# Altium schematic sheet PWR.SchDoc
size A4; SheetNumber: 8; SheetTotal: 8
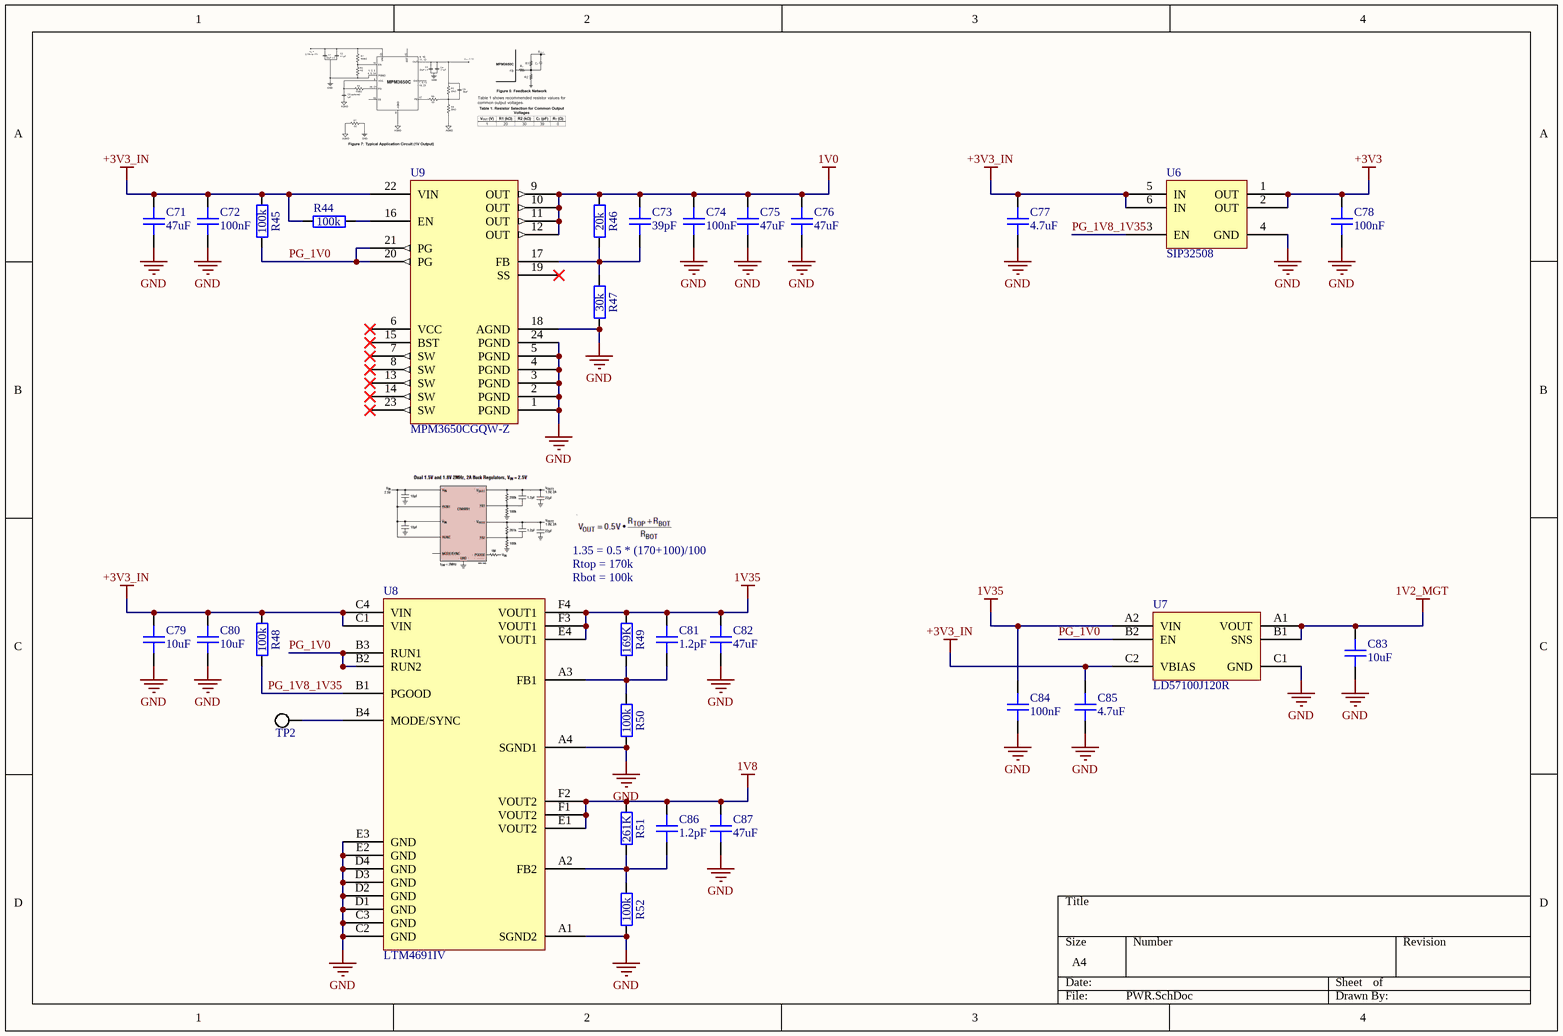
[diagram p0: PWR.SchDoc]

## Parts
C71  47uF  [GEN_C_0805]
C72  100nF  [GEN_C_0402]
C73  39pF  [GEN_C_0402]
C74  100nF  [GEN_C_0402]
C75  47uF  [GEN_C_0805]
C76  47uF  [GEN_C_0805]
C77  4.7uF  [GEN_C_0402]
C78  100nF  [GEN_C_0402]
C79  10uF  [GEN_C_0603]
C80  10uF  [GEN_C_0603]
C81  1.2pF  [GEN_C_0402]
C82  47uF  [GEN_C_0805]
C83  10uF  [GEN_C_0603]
C84  100nF  [GEN_C_0402]
C85  4.7uF  [GEN_C_0402]
C86  1.2pF  [GEN_C_0402]
C87  47uF  [GEN_C_0805]
R44  100k  [GEN_R_0402]
R45  100k  [GEN_R_0402]
R46  20k  [GEN_R_0402]
R47  30k  [GEN_R_0402]
R48  100k  [GEN_R_0402]
R49  169K  [GEN_R_0402]
R50  100k  [GEN_R_0402]
R51  261K  [GEN_R_0402]
R52  100k  [GEN_R_0402]
TP2  PCB  [GEN_TP_PCB]  (value not drawn)  (no BOM)
U6  SIP32508  [VISH_TSOT6]
U7  LD57100J120R  [ST_FlipChip6]
U8  LTM4691IV  [AD_LGA24]
U9  MPM3650CGQW-Z  [MPS_MPM3650]

## Nets
1V0: C73.2 C74.2 C75.2 C76.2 R46.2 U9.9(OUT) U9.10(OUT) U9.11(OUT) U9.12(OUT)
1V2_MGT: C83.2 U7.A1(VOUT) U7.B1(SNS)
1V8: C86.2 C87.2 R51.2 U8.E1(VOUT2) U8.F1(VOUT2) U8.F2(VOUT2)
1V35: C81.2 C82.2 C84.2 R49.2 U7.A2(VIN) U8.E4(VOUT1) U8.F3(VOUT1) U8.F4(VOUT1)
+3V3: C78.2 U6.1(OUT) U6.2(OUT)
+3V3_IN: C71.2 C72.2 C77.2 C79.2 C80.2 C85.2 R44.1 R45.2 R48.2 U6.5(IN) U6.6(IN) U7.C2(VBIAS) U8.C1(VIN) U8.C4(VIN) U9.22(VIN)
GND: C71.1 C72.1 C74.1 C75.1 C76.1 C77.1 C78.1 C79.1 C80.1 C82.1 C83.1 C84.1 C85.1 C87.1 R47.1 R50.1 R52.1 U6.4(GND) U7.C1(GND) U8.A1(SGND2) U8.A4(SGND1) U8.C2(GND) U8.C3(GND) U8.D1(GND) U8.D2(GND) U8.D3(GND) U8.D4(GND) U8.E2(GND) U8.E3(GND) U9.1(PGND) U9.2(PGND) U9.3(PGND) U9.4(PGND) U9.5(PGND) U9.18(AGND) U9.24(PGND)
PG_1V0: R45.1 U7.B2(EN) U8.B2(RUN2) U8.B3(RUN1) U9.20(PG) U9.21(PG)
PG_1V8_1V35: R48.1 U6.3(EN) U8.B1(PGOOD)
NetC73_1: C73.1 R46.1 R47.2 U9.17(FB)
NetC81_1: C81.1 R49.1 R50.2 U8.A3(FB1)
NetC86_1: C86.1 R51.1 R52.2 U8.A2(FB2)
NetR44_2: R44.2 U9.16(EN)
NetTP2_1: TP2.1 U8.B4(MODE/SYNC)

Not connected (* = marked no-connect by the designer): U9 6(VCC)* 7(SW)* 8(SW)* 13(SW)* 14(SW)* 15(BST)* 19(SS)* 23(SW)*

## Notes on the sheet
- 1.35 = 0.5 * (170+100)/100
- Rtop = 170k
- Rbot = 100k

## Library data of the parts
C71 C75 C76 C82 C87 = CAP 47uF 6.3V X5R 0805: Voltage Rating: 6.3V; Package: 0805; Value: 47uF; Supplier 1: Digi-Key; Supplier Part Number 1: 1276-1852-1-ND
C72 C74 C78 C84 = CAP 100nF 16V X7R 0402: Voltage Rating: 16V; Package: 0402; Supplier 1: Digi-Key; Supplier Part Number 1: 490-4759-1-ND; Value: 100nF
C73 = CAP 39pF 50V C0G 0402: Temperature Coefficient: C0G; Voltage Rating: 50V; Package: 0402; Value: 39pF; Supplier 1: Digi-Key; Supplier Part Number 1: 399-C0402C390J5GAC7867CT-ND
C77 C85 = CAP 4.7uF 6.3V X5R 0402: Voltage Rating: 6.3V; Package: 0402; Value: 4.7uF; Supplier 1: Digi-Key; Supplier Part Number 1: 490-5915-1-ND
C79 C80 C83 = CAP 10uF 10V X5R 0603: Voltage Rating: 10V; Package: 0402; Supplier 1: Digi-Key; Supplier Part Number 1: 490-10474-1-ND; Value: 10uF
C81 C86 = CAP 1.2pF 50V C0G 0402: Temperature Coefficient: C0G; Voltage Rating: 50V; Package: 0402; Value: 1.2pF; Supplier 1: Digi-Key; Supplier Part Number 1: 311-1615-1-ND
R44 R45 R48 R50 R52 = RES 100K OHM 1% 1/10W 0402: Tolerance: 1%; Power Rating: 0.1W; Package: 0402; Value: 100k; Supplier 1: Digi-Key; Supplier Part Number 1: 311-100KLRCT-ND
R46 = RES 20K OHM 1% 1/16W 0402: Tolerance: 1%; Power Rating: 0.0625W; Package: 0402; Value: 20k; Supplier 1: Digi-Key; Supplier Part Number 1: 311-20.0KLRCT-ND
R47 = RES 30K OHM 1% 1/16W 0402: Tolerance: 1%; Power Rating: 0.0625W; Package: 0402; Value: 30k; Supplier 1: Digi-Key; Supplier Part Number 1: 311-30.0KLRCT-ND
R49 = RES 169K OHM 1% 1/16W 0402: Tolerance: 1%; Power Rating: 0.0625W; Package: 0402; Value: 169K; Supplier 1: Digi-Key; Supplier Part Number 1: YAG3000CT-ND
R51 = RES 261K OHM 1% 1/16W 0402: Tolerance: 1%; Power Rating: 0.0625W; Package: 0402; Value: 261K; Supplier 1: Digi-Key; Supplier Part Number 1: 311-261KLRCT-ND
TP2 = TP PCB 1mm
U6 = IC SWITCH LOAD SIP32508: Supplier 1: Digi-Key; Supplier Part Number 1: SIP32508DT-T1-GE3CT-ND
U7 = IC LDO LD57100J120R: Supplier 1: Digi-Key; Supplier Part Number 1: 497-LD57100J120RCT-ND
U8 = IC BUCK LTM4691IV: Supplier 1: Digi-Key; Supplier Part Number 1: 505-LTM4691IV#PBF-ND
U9 = IC BUCK MPM3650CGQW-Z: Supplier 1: Digi-Key; Supplier Part Number 1: 1589-MPM3650CGQW-ZCT-ND